# EAGLE schematic schematIMIKU (EAGLE 7.7.0)
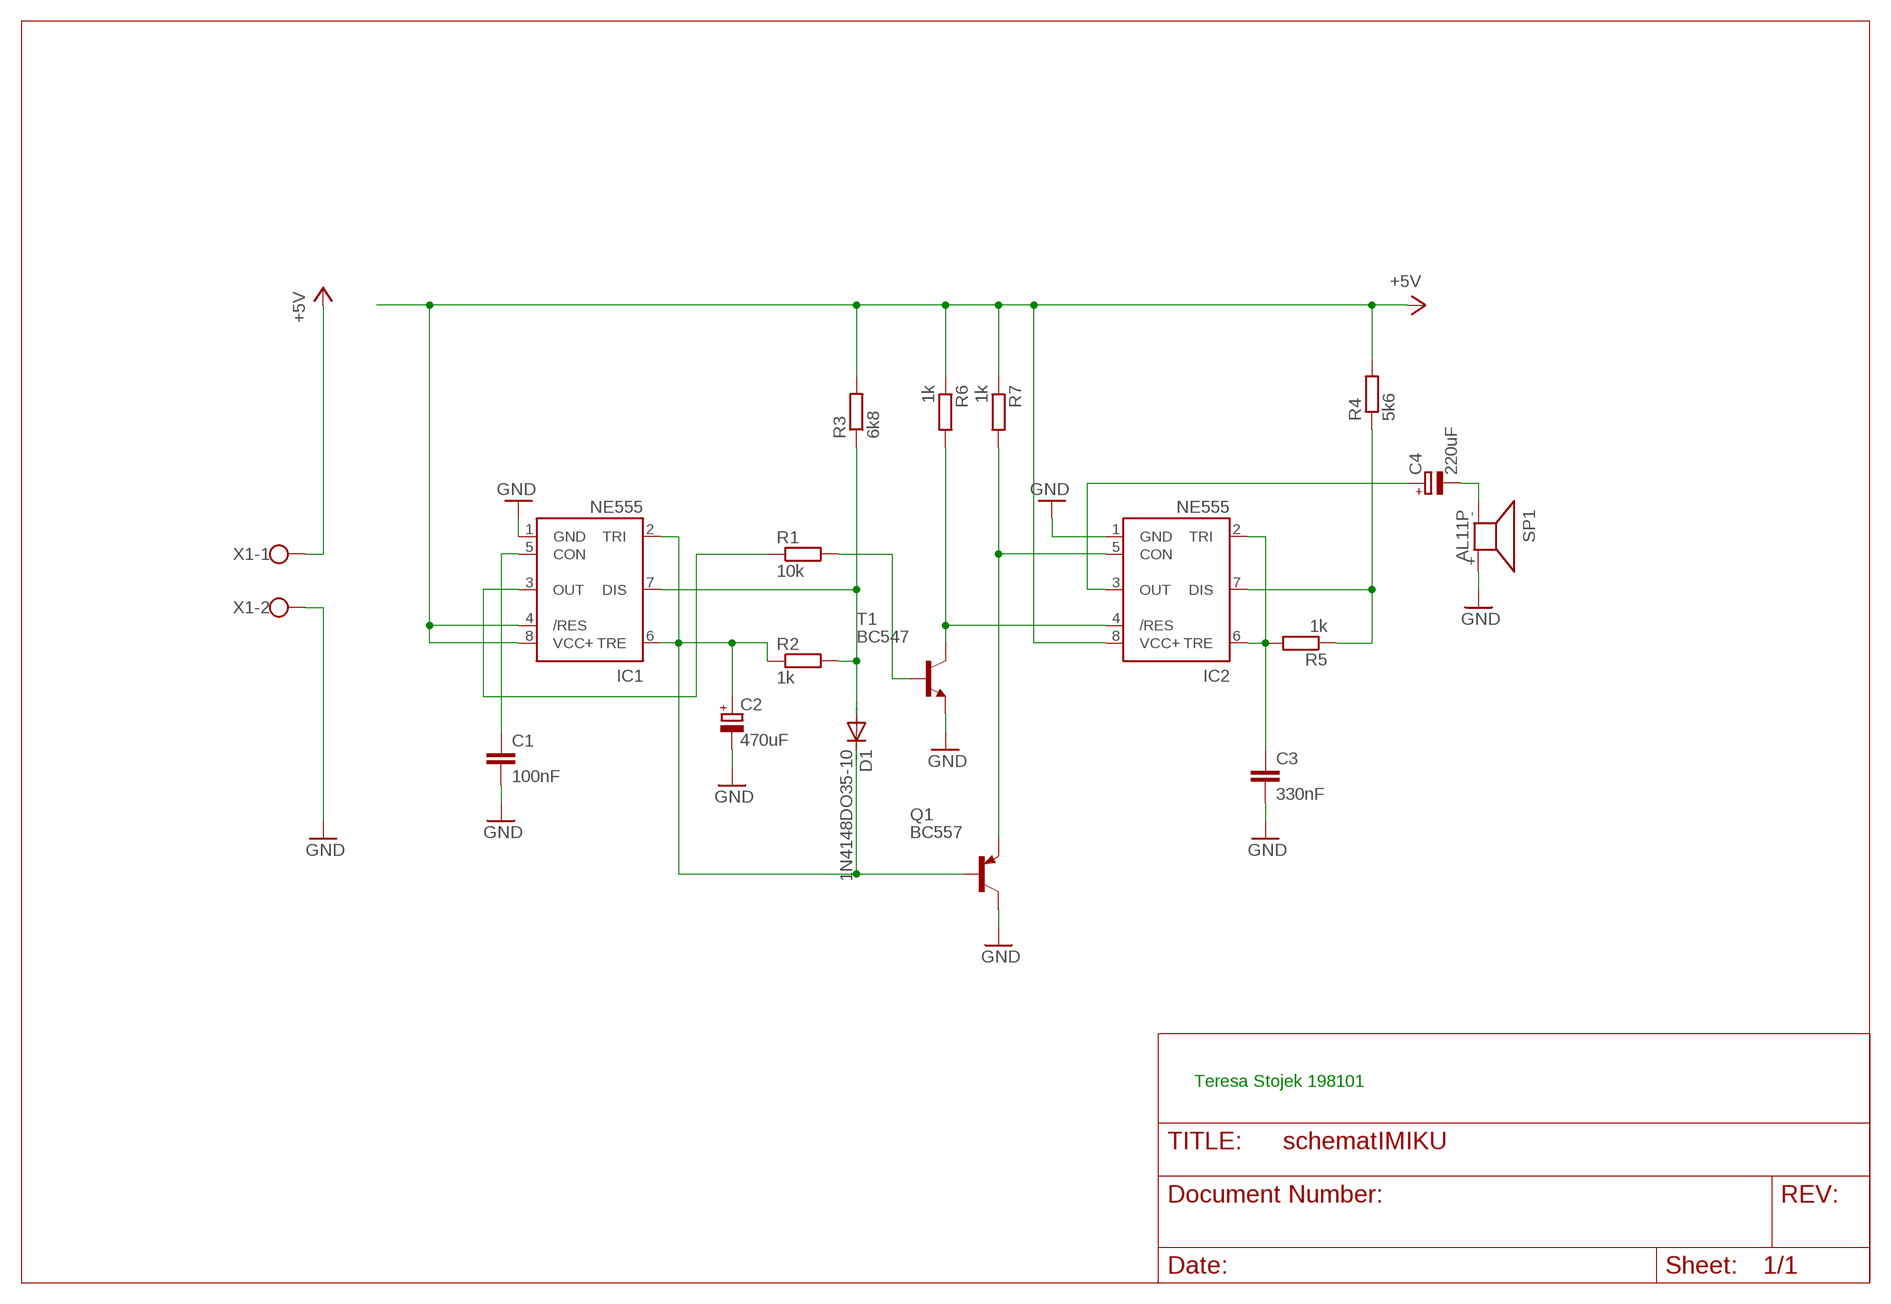
[diagram p0: schematic, sheet 1]

## Parts
C1  100nF  C-EU050-050X075  [C050-050X075]
C2  470uF  CPOL-EU140CLH-1014  [140CLH-1014]
C3  330nF  C-EU050-050X075  [C050-050X075]
C4  220uF  CPOL-EU140CLH-1014  [140CLH-1014]
D1  1N4148DO35-10  [DO35-10]
IC1  NE555  [DIL-08]
IC2  NE555  [DIL-08]
Q1  BC557  [TO92]
R1  10k  R-EU_0207/10  [0207/10]
R2  1k  R-EU_0207/10  [0207/10]
R3  6k8  R-EU_0207/10  [0207/10]
R4  5k6  R-EU_0207/10  [0207/10]
R5  1k  R-EU_0207/10  [0207/10]
R6  1k  R-EU_0207/10  [0207/10]
R7  1k  R-EU_0207/10  [0207/10]
SP1  AL11P  [AL11P]
T1  BC547  [TO92]
X1  W237-102  [W237-102]

## Nets
+5V: IC1.4(/RES) IC1.8(VCC+) IC2.8(VCC+) R3.2 R4.2 R6.1 R7.1 X1.1
GND: C1.2 C2.- C3.2 IC1.1(GND) IC2.1(GND) Q1.3(C) SP1.+ T1.1(E) X1.2
N$1: IC1.3(OUT) R1.1
N$2: D1.A IC1.7(DIS) R2.2 R3.1
N$3: C2.+ D1.C IC1.2(TRI) IC1.6(TRE) Q1.2(B) R2.1
N$4: R1.2 T1.2(B)
N$5: C4.+ IC2.3(OUT)
N$6: C3.1 IC2.2(TRI) IC2.6(TRE) R5.2
N$7: IC2.7(DIS) R4.1 R5.1
N$8: C1.1 IC1.5(CON)
N$9: IC2.4(/RES) R6.2 T1.3(C)
N$10: IC2.5(CON) Q1.1(E) R7.2
N$12: C4.- SP1.-

## Notes on the sheet
- Teresa Stojek 198101

## Library data of the parts
C1 C3 = rcl:C-EU: CAPACITOR, European symbol
C2 C4 = rcl:CPOL-EU: POLARIZED CAPACITOR, European symbol
D1 = diode:1N4148: DIODE high speed (Philips)
IC1 IC2 = st-microelectronics:NE555: General purpose bipolar Timer; MF: Arrow Electronics; MPN: NE555N; OC_FARNELL: 1467742; OC_NEWARK: 89K1486
Q1 = transistor-pnp:BC557: PNP Transistor
R1-R7 = resistor:R-EU_: RESISTOR, European symbol
SP1 = buzzer:AL11P: SPEAKER Source: Buerklin; OC_FARNELL: unknown; OC_NEWARK: unknown
T1 = transistor:BC547: NPN TRANSISTOR
X1 = con-wago-500:W237-102: WAGO SCREW CLAMP; MPN: 237-102; OC_FARNELL: unknown; OC_NEWARK: 70K9898